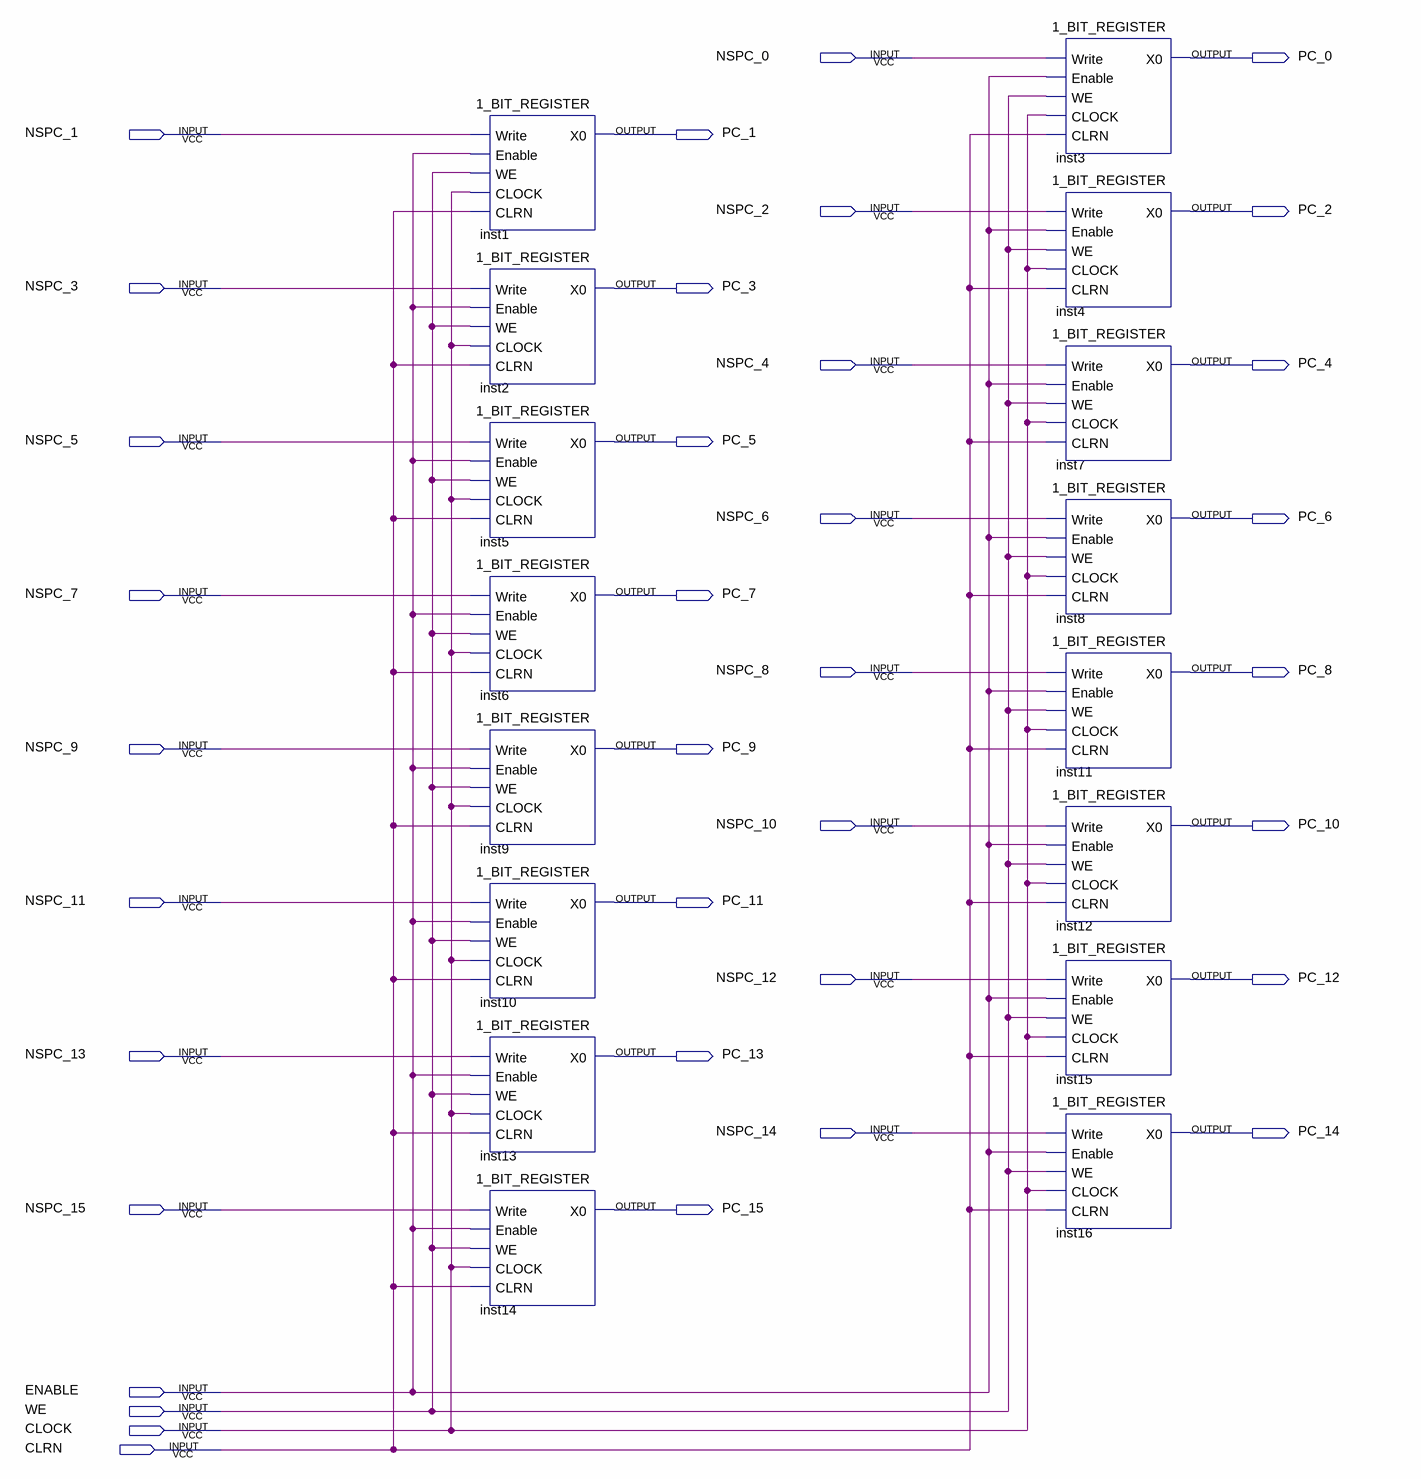
[diagram p0: schematic sheet]
// Quartus schematic PC_BLOCK.bdf as structural Verilog: 16 symbols, 36 pins
module PC_BLOCK (
  input  NSPC_0,
  input  NSPC_1,
  input  NSPC_2,
  input  NSPC_3,
  input  NSPC_4,
  input  NSPC_5,
  input  NSPC_6,
  input  NSPC_7,
  input  NSPC_8,
  input  NSPC_9,
  input  NSPC_10,
  input  NSPC_11,
  input  NSPC_12,
  input  NSPC_13,
  input  NSPC_14,
  input  NSPC_15,
  input  ENABLE,
  input  WE,
  input  CLOCK,
  input  CLRN,
  output PC_0,
  output PC_1,
  output PC_2,
  output PC_3,
  output PC_4,
  output PC_5,
  output PC_6,
  output PC_7,
  output PC_8,
  output PC_9,
  output PC_10,
  output PC_11,
  output PC_12,
  output PC_13,
  output PC_14,
  output PC_15
);

  \1_BIT_REGISTER  inst1 (.Write(NSPC_1), .Enable(ENABLE), .WE(WE), .CLOCK(CLOCK), .CLRN(CLRN), .X0(PC_1));
  \1_BIT_REGISTER  inst2 (.Write(NSPC_3), .Enable(ENABLE), .WE(WE), .CLOCK(CLOCK), .CLRN(CLRN), .X0(PC_3));
  \1_BIT_REGISTER  inst5 (.Write(NSPC_5), .Enable(ENABLE), .WE(WE), .CLOCK(CLOCK), .CLRN(CLRN), .X0(PC_5));
  \1_BIT_REGISTER  inst6 (.Write(NSPC_7), .Enable(ENABLE), .WE(WE), .CLOCK(CLOCK), .CLRN(CLRN), .X0(PC_7));
  \1_BIT_REGISTER  inst9 (.Write(NSPC_9), .Enable(ENABLE), .WE(WE), .CLOCK(CLOCK), .CLRN(CLRN), .X0(PC_9));
  \1_BIT_REGISTER  inst10 (.Write(NSPC_11), .Enable(ENABLE), .WE(WE), .CLOCK(CLOCK), .CLRN(CLRN), .X0(PC_11));
  \1_BIT_REGISTER  inst13 (.Write(NSPC_13), .Enable(ENABLE), .WE(WE), .CLOCK(CLOCK), .CLRN(CLRN), .X0(PC_13));
  \1_BIT_REGISTER  inst14 (.Write(NSPC_15), .Enable(ENABLE), .WE(WE), .CLOCK(CLOCK), .CLRN(CLRN), .X0(PC_15));
  \1_BIT_REGISTER  inst3 (.Write(NSPC_0), .Enable(ENABLE), .WE(WE), .CLOCK(CLOCK), .CLRN(CLRN), .X0(PC_0));
  \1_BIT_REGISTER  inst4 (.Write(NSPC_2), .Enable(ENABLE), .WE(WE), .CLOCK(CLOCK), .CLRN(CLRN), .X0(PC_2));
  \1_BIT_REGISTER  inst7 (.Write(NSPC_4), .Enable(ENABLE), .WE(WE), .CLOCK(CLOCK), .CLRN(CLRN), .X0(PC_4));
  \1_BIT_REGISTER  inst8 (.Write(NSPC_6), .Enable(ENABLE), .WE(WE), .CLOCK(CLOCK), .CLRN(CLRN), .X0(PC_6));
  \1_BIT_REGISTER  inst11 (.Write(NSPC_8), .Enable(ENABLE), .WE(WE), .CLOCK(CLOCK), .CLRN(CLRN), .X0(PC_8));
  \1_BIT_REGISTER  inst12 (.Write(NSPC_10), .Enable(ENABLE), .WE(WE), .CLOCK(CLOCK), .CLRN(CLRN), .X0(PC_10));
  \1_BIT_REGISTER  inst15 (.Write(NSPC_12), .Enable(ENABLE), .WE(WE), .CLOCK(CLOCK), .CLRN(CLRN), .X0(PC_12));
  \1_BIT_REGISTER  inst16 (.Write(NSPC_14), .Enable(ENABLE), .WE(WE), .CLOCK(CLOCK), .CLRN(CLRN), .X0(PC_14));
endmodule
